# EAGLE design Interlock (EAGLE 6.6.0)
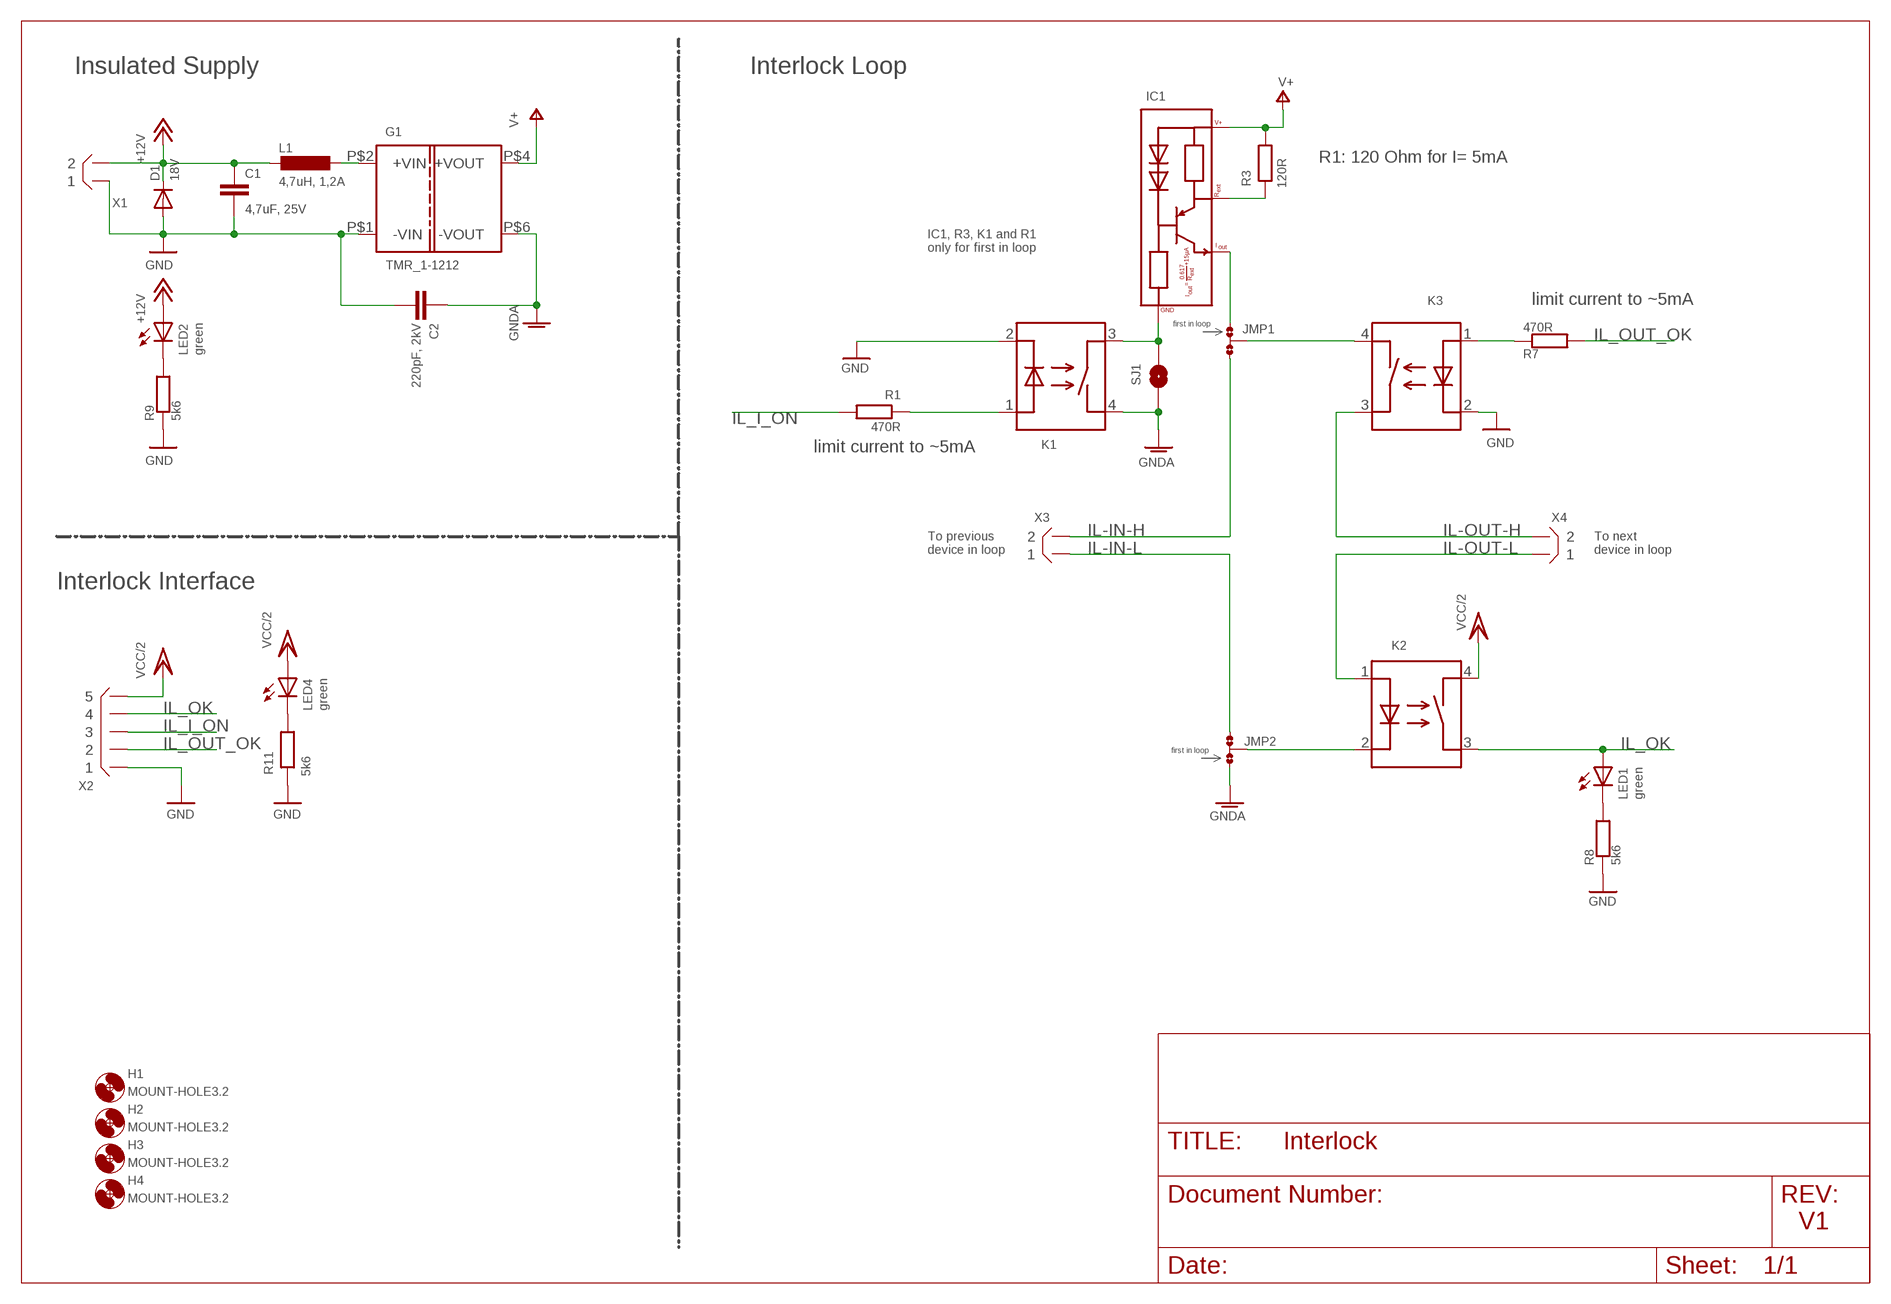
[diagram p0: schematic, sheet 1]

## Parts
C1  4,7uF, 25V  C-EUC0805  [C0805]
C2  220pF, 2kV  CC1210_HV  [C1210_HV]
D1  18V  DIODE-DO214AA  [DO214AA]
G1  TMR_1-1212  TMR_1-1  [TMR_1-??1?]
H1  MOUNT-HOLE3.2  [3,2]
H2  MOUNT-HOLE3.2  [3,2]
H3  MOUNT-HOLE3.2  [3,2]
H4  MOUNT-HOLE3.2  [3,2]
IC1  PSSI2021SAY  [SOT353]
JMP1  0R-JUMPA  [A0R-JMP]
JMP2  0R-JUMPA  [A0R-JMP]
K1  ASSR-1218  [SO-4]
K2  ASSR-1218  [SO-4]
K3  ASSR-1218  [SO-4]
L1  4,7uH, 1,2A  L-EUL3225M  [L3225M]
LED1  green  LEDCHIPLED_0805  [CHIPLED_0805]
LED2  green  LEDCHIPLED_0805  [CHIPLED_0805]
LED4  green  LEDCHIPLED_0805  [CHIPLED_0805]
R1  470R  R  [R0805]
R3  120R  R  [R0805]
R7  470R  R  [R0805]
R8  5k6  R  [R0805]
R9  5k6  R  [R0805]
R11  5k6  R  [R0805]
SJ1  SOLDERJUMPERNO  [SJ_2S-NO]
X1  B2B-XH  [B2B-XH]
X2  B5B-XH  [B5B-XH]
X3  B2B-XH  [B2B-XH]
X4  B2B-XH  [B2B-XH]

## Nets
+12V: C1.1 D1.C L1.2 LED2.A X1.P$2
GND: C1.2 C2.P$1 D1.A G1.P$1(-VIN) K1.2(I-) K3.2(I-) R8.1 R9.1 R11.1 X1.P$1 X2.P$1
GNDA: C2.P$2 G1.P$6(-VOUT) JMP2.1 K1.4(O1) SJ1.1
IL-IN-H: JMP1.3 X3.P$2
IL-IN-L: JMP2.3 X3.P$1
IL-OUT-H: K3.3(O2) X4.P$2
IL-OUT-L: K2.1(I+) X4.P$1
IL_I_ON: R1.2 X2.P$3
IL_OK: K2.3(O2) LED1.A X2.P$4
IL_OUT_OK: R7.2 X2.P$2
N$1: IC1.4(REXT) R3.1
N$2: G1.P$2(+VIN) L1.1
N$3: K3.1(I+) R7.1
N$4: JMP1.2 K3.4(O1)
N$6: IC1.2(IOUT) JMP1.1
N$7: JMP2.2 K2.2(I-)
N$8: IC1.3(GND) K1.3(O2) SJ1.2
N$9: LED2.C R9.2
N$10: K1.1(I+) R1.1
N$12: LED4.C R11.2
N$29: LED1.C R8.2
V+: G1.P$4(+VOUT) IC1.5(VSS) R3.2
VCC/2: K2.4(O1) LED4.A X2.P$5

## Notes on the sheet
- Insulated Supply | Interlock Loop
- R1: 120 Ohm for I= 5mA
- IC1, R3, K1 and R1
  only for first in loop
- limit current to ~5mA
- first in loop
- limit current to ~5mA
- To previous
  device in loop
- To next
  device in loop
- Interlock Interface
- first in loop
- V1

## Library data of the parts
C1 = rcl:C-EU: CAPACITOR, European symbol
C2 = useful:C
D1 = diode:DIODE-: DIODE
G1 = traco-power:TMR_1-??1?
H1-H4 = holes:MOUNT-HOLE: MOUNTING HOLE with drill center marker
IC1 = nxp:PSSI2021SAY
JMP1 JMP2 = jumper:0R-JUMP: SMD 0R 0805 Jumper
K1-K3 = special:ASSR-1218
L1 = rcl:L-EU: INDUCTOR, European symbol
LED1 LED2 LED4 = led:LED: LED OSRAM: - CHIPLED LG R971, LG N971, LY N971, LG Q971, LY Q971, LO R971, LY R971 LH N974, LH R974 LS Q976, LO Q976, LY Q976 LO Q996 - Hyper CHIPLED LW Q18S LB Q993, LB Q99A, LB R99A - SideLED LS A670, LO A670, LY A670, LG A670, LP A670 LB A673, LV A673, LT A673, LW A673 LH A674 LY A675 LS A676, LA A676, LO A676, LY A676, LW A676 LS A679, LY A679, LG A679 - Hyper Micro SIDELED® LS Y876, LA Y876, LO Y876, LY Y876 LT Y87S - SmartLED LW L88C, LW L88S LB L89C, LB L89S, LG L890 LS L89K, LO L89K, LY L89K LS L896, LA L896, LO L896, LY L896 - TOPLED LS T670, LO T670, LY T670, LG T670, LP T670 LSG T670, LSP T670, LSY T670, LOP T670, LYG T670 LG T671, LOG T671, LSG T671 LB T673, LV T673, LT T673, LW T673 LH T674 LS T676, LA T676, LO T676, LY T676, LB T676, LH T676, LSB T676, LW T676 LB T67C, LV T67C, LT T67C, LS T67K, LO T67K, LY T67K, LW E67C LS E67B, LA E67B, LO E67B, LY E67B, LB E67C, LV E67C, LT E67C LW T67C LS T679, LY T679, LG T679 LS T770, LO T770, LY T770, LG T770, LP T770 LB T773, LV T773, LT T773, LW T773 LH T774 LS E675, LA E675, LY E675, LS T675 LS T776, LA T776, LO T776, LY T776, LB T776 LHGB T686 LT T68C, LB T68C - Hyper Mini TOPLED® LB M676 - Mini TOPLED Santana® LG M470 LS M47K, LO M47K, LY M47K Source: http://www.osram.convergy.de LUXEON: - LUMILED® LXK2-PW12-R00, LXK2-PW12-S00, LXK2-PW14-U00, LXK2-PW14-V00 LXK2-PM12-R00, LXK2-PM12-S00, LXK2-PM14-U00 LXK2-PE12-Q00, LXK2-PE12-R00, LXK2-PE12-S00, LXK2-PE14-T00, LXK2-PE14-U00 LXK2-PB12-K00, LXK2-PB12-L00, LXK2-PB12-M00, LXK2-PB14-N00, LXK2-PB14-P00, LXK2-PB14-Q00 LXK2-PR12-L00, LXK2-PR12-M00, LXK2-PR14-Q00, LXK2-PR14-R00 LXK2-PD12-Q00, LXK2-PD12-R00, LXK2-PD12-S00 LXK2-PH12-R00, LXK2-PH12-S00 LXK2-PL12-P00, LXK2-PL12-Q00, LXK2-PL12-R00 Source: www.luxeon.com KINGBRIGHT: KA-3528ASYC Source: www.kingbright.com
R1 R3 R7-R9 R11 = useful:R
SJ1 = jumper:SOLDERJUMPER: Solder Jumper Standard SMD solder jumper. Used to automate production. Two varients : Normally Open and Normally Closed are the same, but have different paste layers. NC will have a large amount of paste and should jumper during reflow.
X1 X3 X4 = con-jst-xh:?2B-XH
X2 = con-jst-xh:?5B-XH

## Board
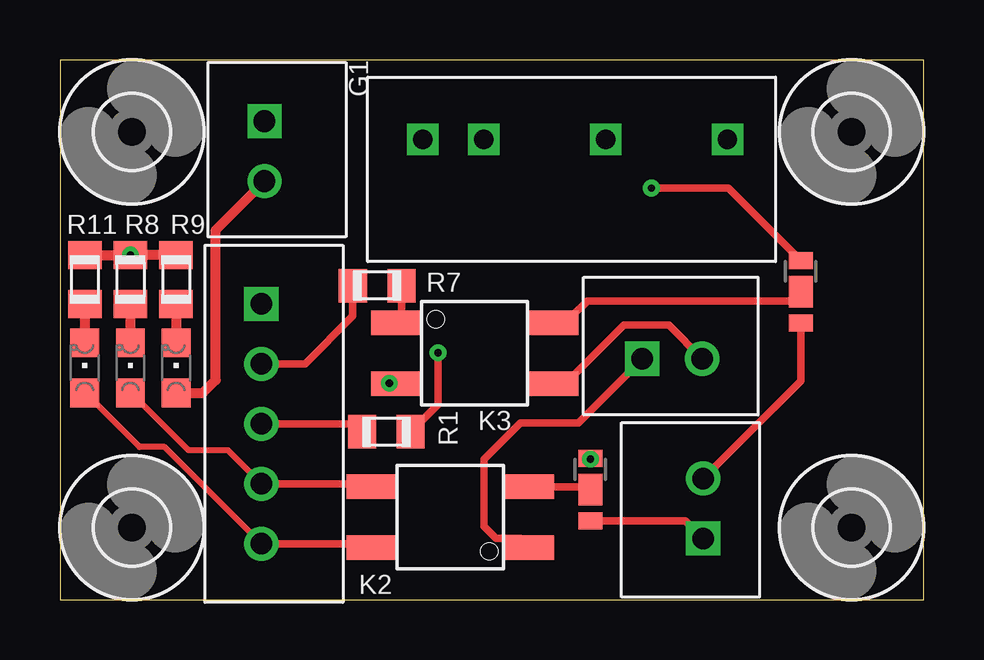
[diagram p1: board, top side]
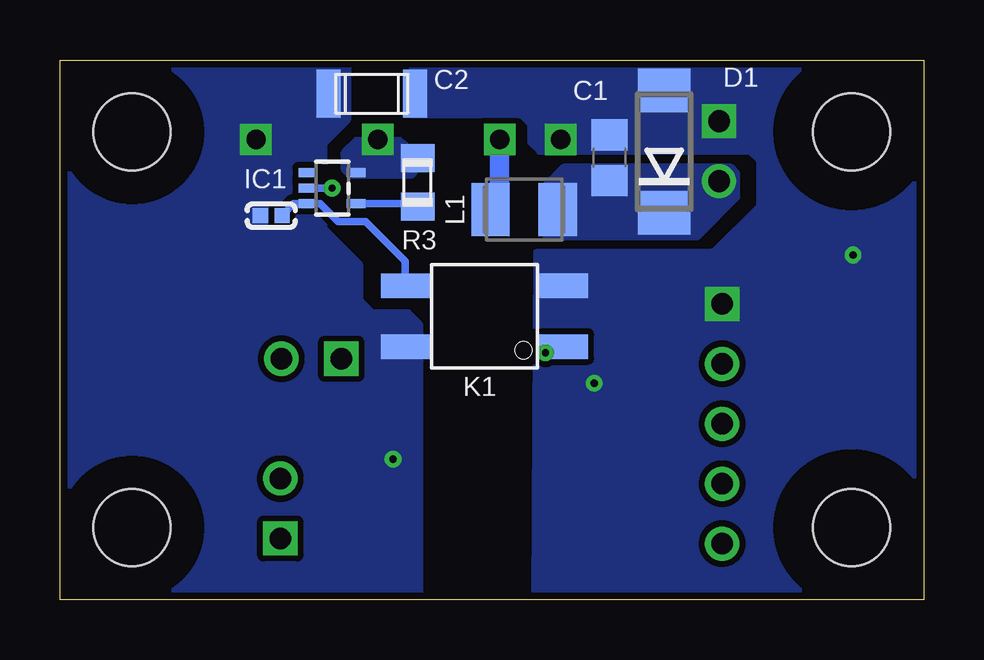
[diagram p2: board, bottom side, seen from below]

Size 36 x 22.5 mm. Coordinates in mm from the lower left corner, seen from the top.
Outline: 0,0 36,0 36,22.5 0,22.5 0,0
Copper layers (1+2*15+16): Top 0.035mm / dielectric 0.2mm / Route2 0.035mm / dielectric 0.5mm / Route15 0.035mm / dielectric 0.2mm / Bottom 0.035mm
Design rules "ats_35u_4layer_2 *": minimum track width 10mil, minimum drill 0.2mm, track to track 10mil, track to pad 10mil, pad to pad 10mil, via to via 10mil, smd to smd 10mil, copper to edge 0.3mm, drill to drill 8mil, minimum pad ring 10mil, minimum via ring 0.2mm, stop-mask expansion 4mil, vias tented up to drill 0mil, thermal gap 10mil

### Footprints (pad centres in the part's own frame; a part is rotated, then mirrored left to right if it is on the bottom)
C0805 = smd 1.3 x 1.5: 1 -0.95,0; 2 0.95,0
C1210_HV = smd 1 x 2: P$1 -1.8,0; P$2 1.8,0
DO214AA = smd 1.8 x 2.2: A 2.55,0; C -2.55,0
TMR_1-??1? = drill 0.8 square: P$1 0,0; P$2 2.54,0; P$4 7.62,0; P$6 12.7,0
3,2 = hole 3.2: 0,0
SOT353 = smd 0.38 x 0.8: 1 -0.65,-1; 2 0,-1; 3 0.65,-1; 4 0.65,1; 5 -0.65,1
A0R-JMP = smd 1 x 0.7: 1 0,1.3; 3 0,-1.3 | smd 1 x 1.3: 2 0,0
SO-4 = smd 1.016 x 2.032: 1 -1.27,-3.302; 2 1.27,-3.302; 3 1.27,3.302; 4 -1.27,3.302
L3225M = smd 1.6 x 2.2: 1 -1.4,0; 2 1.4,0
CHIPLED_0805 = smd 1.2 x 1.2: A 0,-1.05; C 0,1.05
R0805 = smd 1.168 x 1.397: 1 -1.016,0; 2 1.016,0
SJ_2S-NO = smd 0.635 x 0.635: 1 -0.45,0; 2 0.45,0
B2B-XH = drill 0.9 pad 1.422 square: P$1 0,0 | drill 0.9 pad 1.422: P$2 2.5,0
B5B-XH = drill 0.9 pad 1.422 square: P$1 0,0 | drill 0.9 pad 1.422: P$2 2.5,0; P$3 5,0; P$4 7.5,0; P$5 10,0

### Placement (x,y rotation side)
C1  13.1,18.42 90 bottom
C2  23,21.09 180 bottom
D1  10.81,18.68 90 bottom
G1  15.13,19.18 0 top
H1  3,3 0 top
H2  33,3 0 top
H3  3,19.5 0 top
H4  33,19.5 0 top
IC1  24.65,17.15 270 bottom
JMP1  30.88,12.84 0 top
JMP2  22.11,4.58 0 top
K1  18.3,11.82 90 bottom
K2  16.27,3.44 90 top
K3  17.29,10.27 270 top
L1  16.65,16.26 0 bottom
LED1  2.94,9.66 0 top
LED2  4.84,9.66 0 top
LED4  1.03,9.66 0 top
R1  13.61,6.99 180 top
R3  21.09,17.39 90 bottom
R7  13.22,13.09 180 top
R8  2.94,13.34 270 top
R9  4.84,13.34 270 top
R11  1.03,13.34 270 top
SJ1  27.19,16.01 0 bottom
X1  8.53,19.95 270 top
X2  8.4,12.33 270 top
X3  26.81,2.55 90 top
X4  24.27,10.04 0 top

### Tracks (layer width: path | path; a pad name or v marks a point on that pad's centre or on a via)
+12V
  Top 0.406: LED2.A 5.95,8.61 6.49,9.15 6.49,15.41 X1.P$2
  pour Bottom (isolate 0.254, no thermals): 8.02,18.04 15,18.04 15.76,17.28 15.76,15.12 9.41,15.12 7.76,16.77 7.76,17.79
GND  (via drill 0.3)
  Top 0.305: K3.2 v13.73,9.03
  Top 0.406: R9.1 R8.1 R11.1
  other vias: 2.94,14.36
  pour Bottom (isolate 0.254, no thermals): 0.02,22.49 21.35,22.49 21.35,20.2 16.78,20.2 16.4,19.82 16.4,19.06 16.02,18.68 7.26,18.68 6.87,18.3 6.87,16.39 8.78,14.49 16.16,14.49 16.25,0.01 0.02,0.01
GNDA  (via drill 0.3)
  Top 0.305: v22.11,5.85 JMP2.1
  pour Bottom (no thermals): 24,22.5 24,20 25,19 25,15.5 23.5,14 23.5,12.5 23,12 21.5,12 21,11.5 21,0 35.96,0.01 35.96,22.49
IL-IN-H
  Top 0.305: X3.P$2 30.11,8.35 30.88,9.11 JMP1.3
IL-IN-L
  Top 0.305: JMP2.3 26.08,3.28 X3.P$1
IL-OUT-H
  Top 0.305: K3.3 21.35,9 21.35,9.28 23.51,11.44 25.38,11.44 X4.P$2
IL-OUT-L
  Top 0.305: K2.1 19.19,2.55 18.18,2.55 17.67,3.06 17.67,5.85 19.19,7.37 21.61,7.37 X4.P$1
IL_I_ON
  Top 0.305: R1.2 12.26,7.33 X2.P$3
IL_OK
  Top 0.254: LED1.A 2.97,8.61 5.35,6.23 6.99,6.23 X2.P$4
  Top 0.305: K2.3 12.85,4.83 X2.P$4
IL_OUT_OK
  Top 0.305: R7.2 12.21,11.82 10.22,9.83 X2.P$2
N$1
  Bottom 0.305: IC1.4 21.09,16.5 R3.1
N$2
  Bottom 0.813: G1.P$2 17.67,16.65 L1.1
N$3
  Top 0.305: K3.1 14.24,11.79 R7.1
N$4
  Top 0.254: 30.5,12.45 JMP1.2
  Top 0.305: K3.4 20.87,11.82 21.35,11.82 21.99,12.45 27.45,12.45 30.5,12.45
N$6  (via drill 0.3)
  Top 0.305: v24.65,17.15 25.7,17.15 27.86,17.15 JMP1.1
  Bottom 0.305: IC1.2 v24.65,17.15
N$7
  Top 0.305: K2.2 21.99,4.71 JMP2.2
N$8
  Bottom 0.305: SJ1.2 26.25,16.5 IC1.3 25.15,16.5 24.4,15.76 23.26,15.76 21.61,14.11 K1.3
N$9
  Top 0.406: R9.2 LED2.C
N$10  (via drill 0.3)
  Top 0.305: R1.1 15.76,8.14 v15.76,10.29
  Bottom 0.305: v15.76,10.29 15.76,10.55 K1.1
N$12
  Top 0.406: R11.2 LED4.C
N$29
  Top 0.406: R8.2 LED1.C
V+
  pour Bottom (no thermals): 21.86,19.18 21.23,18.68 21.23,17.79 21.35,17.66 23.89,17.66 24.15,17.91 24.15,18.68 23.64,19.18
VCC/2
  Top 0.254: LED4.A 1.07,8.61 3.32,6.36 4.37,6.36 X2.P$5
  Top 0.305: K2.4 12.81,2.33 X2.P$5

### Text on the board
tTest: first | OUT-H | V+ | IL | first | IN-H | Interlock / Loop V1 | 12V | IN-L
bTest: disable / second / input | Tera TU Graz | Pöschl | Version 1 | Interlock Interface